# Altium schematic sheet control_unit.SchDoc
size A3
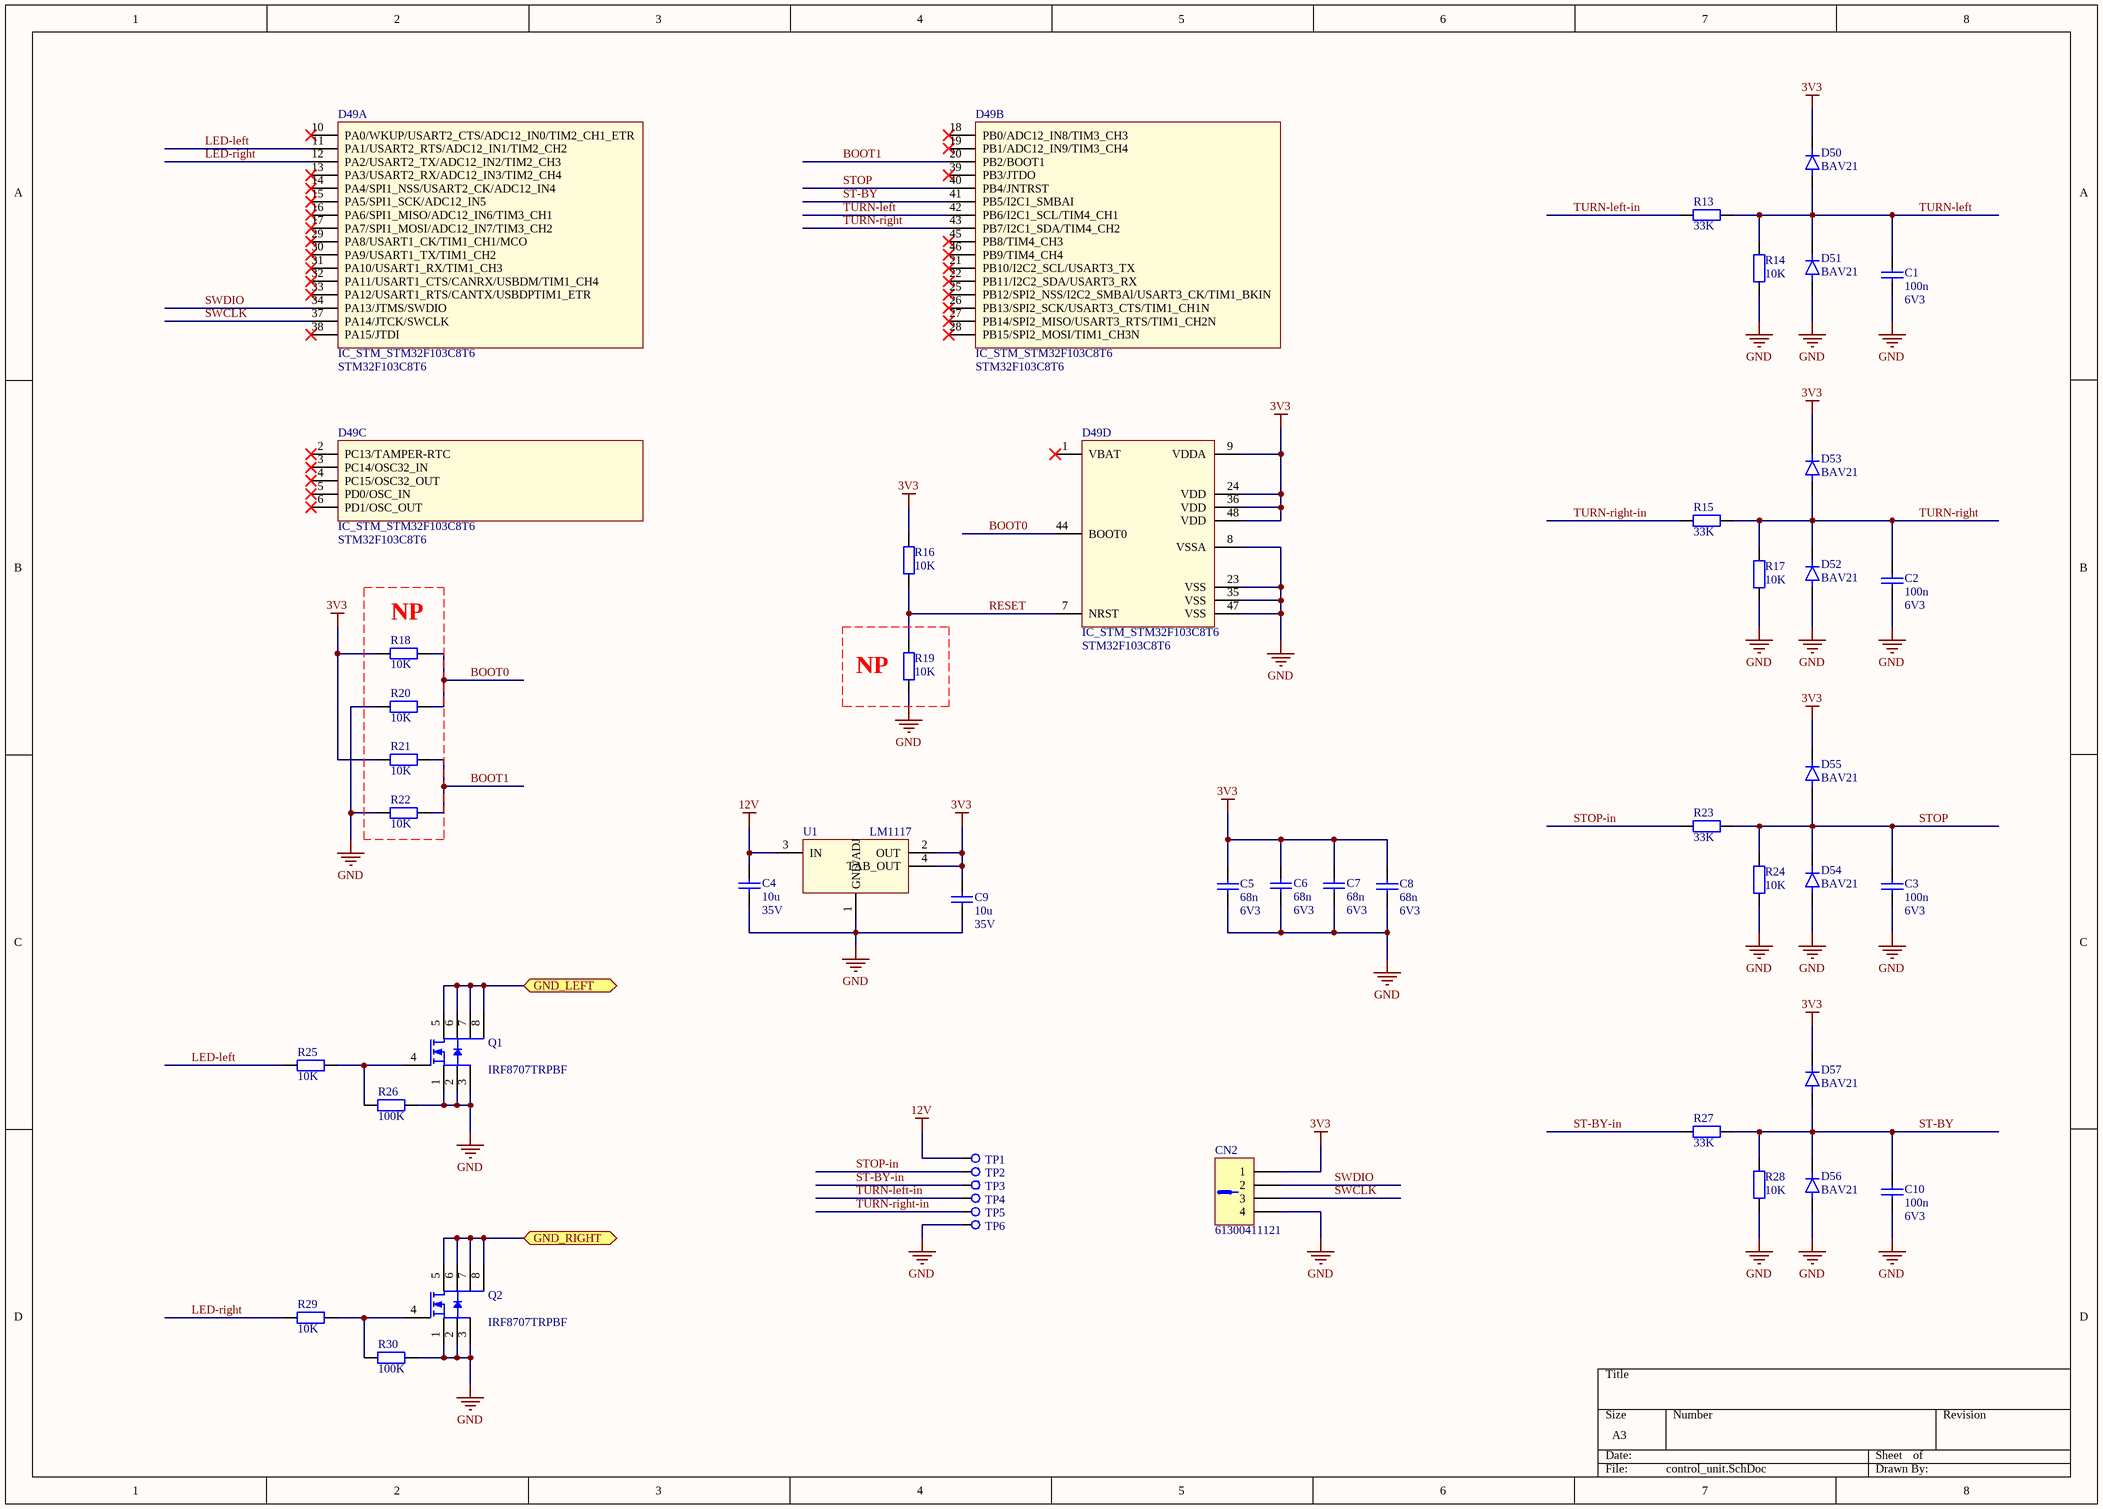
[diagram p0: control_unit.SchDoc]

## Parts
C1  Value1: 100n  Value2: 6V3  [CAPC2012X88N]  (hidden comment: CAP)
C2  Value1: 100n  Value2: 6V3  [CAPC2012X88N]  (hidden comment: CAP)
C3  Value1: 100n  Value2: 6V3  [CAPC2012X88N]  (hidden comment: CAP)
C4  Value1: 10u  Value2: 35V  [CAPC3216X18N]  (hidden comment: CAP)
C5  Value1: 68n  Value2: 6V3  [CAPC2012X100N]  (hidden comment: CAP)
C6  Value1: 68n  Value2: 6V3  [CAPC2012X100N]  (hidden comment: CAP)
C7  Value1: 68n  Value2: 6V3  [CAPC2012X100N]  (hidden comment: CAP)
C8  Value1: 68n  Value2: 6V3  [CAPC2012X100N]  (hidden comment: CAP)
C9  Value1: 10u  Value2: 35V  [CAPC3216X18N]  (hidden comment: CAP)
C10  Value1: 100n  Value2: 6V3  [CAPC2012X88N]  (hidden comment: CAP)
CN2  Value1: 61300411121  [CN_WURTH_61300411121]  (hidden comment: CN_1X4M)
D49  IC_STM_STM32F103C8T6  Value1: STM32F103C8T6  [TSQFP50P900X900X160-48N]  (parts A,B,C,D of 4)
D50  Value1: BAV21  [SODFL370X136-2M]  (hidden comment: DIO)
D51  Value1: BAV21  [SODFL370X136-2M]  (hidden comment: DIO)
D52  Value1: BAV21  [SODFL370X136-2M]  (hidden comment: DIO)
D53  Value1: BAV21  [SODFL370X136-2M]  (hidden comment: DIO)
D54  Value1: BAV21  [SODFL370X136-2M]  (hidden comment: DIO)
D55  Value1: BAV21  [SODFL370X136-2M]  (hidden comment: DIO)
D56  Value1: BAV21  [SODFL370X136-2M]  (hidden comment: DIO)
D57  Value1: BAV21  [SODFL370X136-2M]  (hidden comment: DIO)
Q1  Value1: IRF8707TRPBF  [SOIC127P600X175-8N]  (hidden comment: TRS_INFINEON_IRF8707TRPBF)
Q2  Value1: IRF8707TRPBF  [SOIC127P600X175-8N]  (hidden comment: TRS_INFINEON_IRF8707TRPBF)
R13  Value1: 33K  [RESC2012X60N]  (hidden comment: RES)
R14  Value1: 10K  [RESC2012X60N]  (hidden comment: RES)
R15  Value1: 33K  [RESC2012X60N]  (hidden comment: RES)
R16  Value1: 10K  [RESC2012X60N]  (hidden comment: RES)
R17  Value1: 10K  [RESC2012X60N]  (hidden comment: RES)
R18  Value1: 10K  [RESC2012X60N]  (hidden comment: RES)
R19  Value1: 10K  [RESC2012X60N]  (hidden comment: RES)
R20  Value1: 10K  [RESC2012X60N]  (hidden comment: RES)
R21  Value1: 10K  [RESC2012X60N]  (hidden comment: RES)
R22  Value1: 10K  [RESC2012X60N]  (hidden comment: RES)
R23  Value1: 33K  [RESC2012X60N]  (hidden comment: RES)
R24  Value1: 10K  [RESC2012X60N]  (hidden comment: RES)
R25  Value1: 10K  [RESC2012X60N]  (hidden comment: RES)
R26  Value1: 100K  [RESC2012X60N]  (hidden comment: RES)
R27  Value1: 33K  [RESC2012X60N]  (hidden comment: RES)
R28  Value1: 10K  [RESC2012X60N]  (hidden comment: RES)
R29  Value1: 10K  [RESC2012X60N]  (hidden comment: RES)
R30  Value1: 100K  [RESC2012X60N]  (hidden comment: RES)
TP1  MSC_TP  [MSC_TP_THT1MM]  (value not drawn)  (no BOM)
TP2  MSC_TP  [MSC_TP_THT1MM]  (value not drawn)  (no BOM)
TP3  MSC_TP  [MSC_TP_THT1MM]  (value not drawn)  (no BOM)
TP4  MSC_TP  [MSC_TP_THT1MM]  (value not drawn)  (no BOM)
TP5  MSC_TP  [MSC_TP_THT1MM]  (value not drawn)  (no BOM)
TP6  MSC_TP  [MSC_TP_THT1MM]  (value not drawn)  (no BOM)
U1  Value1: LM1117  [IC_TI_LM1117]  (hidden comment: IC_TI_LM1117)

## Ports
GND_LEFT, GND_RIGHT

## Nets
3V3: C5.2 C6.2 C7.2 C8.2 C9.2 CN2.1 D49.9(VDDA) D49.24(VDD) D49.36(VDD) D49.48(VDD) D50.1(K) D53.1(K) D55.1(K) D57.1(K) R16.2 R18.1 R21.1 U1.2(OUT) U1.4(TAB_OUT)
12V: C4.2 TP1.1 U1.3(IN)
GND: C1.1 C2.1 C3.1 C4.1 C5.1 C6.1 C7.1 C8.1 C9.1 C10.1 CN2.4 D49.8(VSSA) D49.23(VSS) D49.35(VSS) D49.47(VSS) D51.2(A) D52.2(A) D54.2(A) D56.2(A) Q1.1(S) Q1.2(S) Q1.3(D) Q2.1(S) Q2.2(S) Q2.3(D) R14.1 R17.2 R19.1 R20.1 R22.1 R24.2 R26.2 R28.1 R30.2 TP6.1 U1.1(GND/ADJ)
BOOT0: D49.44(BOOT0) R18.2 R20.2
BOOT1: D49.20(PB2/BOOT1) R21.2 R22.2
GND_LEFT: Q1.5(D) Q1.6(D) Q1.7(D) Q1.8(D) ; port GND_LEFT
GND_RIGHT: Q2.5(D) Q2.6(D) Q2.7(D) Q2.8(D) ; port GND_RIGHT
LED-left: D49.11(PA1/USART2_RTS/ADC12_IN1/TIM2_CH2) R25.2
LED-right: D49.12(PA2/USART2_TX/ADC12_IN2/TIM2_CH3) R29.2
RESET: D49.7(NRST) R16.1 R19.2
ST-BY: C10.2 D49.41(PB5/I2C1_SMBAI) D56.1(K) D57.2(A) R27.2 R28.2
ST-BY-in: R27.1 TP3.1
STOP: C3.2 D49.40(PB4/JNTRST) D54.1(K) D55.2(A) R23.2 R24.1
STOP-in: R23.1 TP2.1
SWCLK: CN2.3 D49.37(PA14/JTCK/SWCLK)
SWDIO: CN2.2 D49.34(PA13/JTMS/SWDIO)
TURN-left: C1.2 D49.42(PB6/I2C1_SCL/TIM4_CH1) D50.2(A) D51.1(K) R13.2 R14.2
TURN-left-in: R13.1 TP4.1
TURN-right: C2.2 D49.43(PB7/I2C1_SDA/TIM4_CH2) D52.1(K) D53.2(A) R15.2 R17.1
TURN-right-in: R15.1 TP5.1
NetQ1_4: Q1.4(G) R25.1 R26.1
NetQ2_4: Q2.4(G) R29.1 R30.1

Not connected (* = marked no-connect by the designer): D49 1(VBAT)* 2(PC13/TAMPER-RTC)* 3(PC14/OSC32_IN)* 4(PC15/OSC32_OUT)* 5(PD0/OSC_IN)* 6(PD1/OSC_OUT)* 10(PA0/WKUP/USART2_CTS/ADC12_IN0/TIM2_CH1_ETR)* 13(PA3/USART2_RX/ADC12_IN3/TIM2_CH4)* 14(PA4/SPI1_NSS/USART2_CK/ADC12_IN4)* 15(PA5/SPI1_SCK/ADC12_IN5)* 16(PA6/SPI1_MISO/ADC12_IN6/TIM3_CH1)* 17(PA7/SPI1_MOSI/ADC12_IN7/TIM3_CH2)* 18(PB0/ADC12_IN8/TIM3_CH3)* 19(PB1/ADC12_IN9/TIM3_CH4)* 21(PB10/I2C2_SCL/USART3_TX)* 22(PB11/I2C2_SDA/USART3_RX)* 25(PB12/SPI2_NSS/I2C2_SMBAl/USART3_CK/TIM1_BKIN)* 26(PB13/SPI2_SCK/USART3_CTS/TIM1_CH1N)* 27(PB14/SPI2_MISO/USART3_RTS/TIM1_CH2N)* 28(PB15/SPI2_MOSI/TIM1_CH3N)* 29(PA8/USART1_CK/TIM1_CH1/MCO)* 30(PA9/USART1_TX/TIM1_CH2)* 31(PA10/USART1_RX/TIM1_CH3)* 32(PA11/USART1_CTS/CANRX/USBDM/TIM1_CH4)* 33(PA12/USART1_RTS/CANTX/USBDPTIM1_ETR)* 38(PA15/JTDI)* 39(PB3/JTDO)* 45(PB8/TIM4_CH3)* 46(PB9/TIM4_CH4)*

## Notes on the sheet
- (near R18) NP
- (near R19) NP

## Library data of the parts
C1-C3 C10 = 01_00637: X7R 10% 0805; Manufacturer: KEMET; Manufacturer PN: C0805C104K9RACTU; AutoId: 637; DeviceType: capacitor; SubType: Ceramic; Id: 01_00637; Status: 2 - Checked and Approved; MountType: SMT; ComponentLink1URL: X:\01_Datasheets\CAP_KEMET_CxxxxCxxxXxRAC.pdf; Supplier 1: Farnell; Supplier Part Number 1: 80-C0805C104K9R; ComponentLink1Description: Datasheet
C4 C9 = 01_01484: MURATA - GRM31CR6YA106KA12L - CAP, MLCC, X5R, 10UF, 35V, 1206; AutoId: 1484; DeviceType: capacitor; SubType: Ceramic; Id: 01_01484; Manufacturer: Murata; Manufacturer PN: GRM31CR6YA106KA12L; Status: 2 - Checked and Approved; MountType: SMD; ComponentLink1URL: X:\01_dataSheets\CAP_MURATA_GRM31CR6YA106KA12L.pdf; Supplier 1: Farnell; Supplier Part Number 1: 1797011; ComponentLink1Description: Datasheet
C5-C8 = 01_00635: X7R 10% 0805; Manufacturer: KEMET; Manufacturer PN: C0805C683K9RACTU; AutoId: 635; DeviceType: capacitor; SubType: Ceramic; Id: 01_00635; Status: 2 - Checked and Approved; MountType: SMT; ComponentLink1URL: X:\01_Datasheets\CAP_KEMET_CxxxxCxxxXxRAC.pdf; Supplier 1: Farnell; ComponentLink1Description: Datasheet
CN2 = 02_00034: 4 pin male pin header, pitch 2.54mm; Manufacturer: Wurth Electronics; AutoId: 36; Value3: 4 pin; DeviceType: Connector_4; SubType: 1x4; Id: 02_00034; Manufacturer PN: 61300411121; Status: 2 - Checked and Approved; MountType: THT; ComponentLink1Description: Datasheet; ComponentLink1URL: X:\01_Datasheets\CN_WURTH_6130xx11121.pdf; ComponentLink2Description: ComponentVerificationSheet; ComponentLink2URL: X:\02_ComponentVerificationSheets\CN_WURTH_61300411121_ComponentVerificationSheet.xlsx; Supplier 1: Wurth; Supplier Part Number 1: 61300411121
D49 = 07_00285: MCU 32BIT Cortex M3 64KB 20KB RAM 2X12 ADC; Manufacturer: STM; AutoId: 292; Value2: Microcontroller; Value3: ARM 32bit; DeviceType: IC; Id: 07_00285; Manufacturer PN: STM32F103C8T6; Status: 0 - Unchecked; MountType: SMT; ComponentLink1Description: Datasheet; ComponentLink1URL: X:\01_Datasheets\IC_STM_STM32F103C8T6.pdf; ComponentLink2Description: ComponentVerificationSheet; ComponentLink2URL: X:\02_ComponentVerificationSheets\; Supplier 1: Mouser; Supplier Part Number 1: 511-STM32F103C8T6
D50-D57 = 03_00081: Diodes - General Purpose, Power, Switching 250V 625mA 1A IFSM; Manufacturer: Vishay; Manufacturer PN: BAV21W-E3-08; AutoId: 91; Value2: 250V 250mA; Value3: Diode; Id: 03_00081; DeviceType: diode; SubType: general; Status: 0 - Unchecked; MountType: SMD; ComponentLink1Description: Datasheet; ComponentLink1URL: X:\01_Datasheets\DIO_Vishay_BAV21.pdf; ComponentLink2Description: ComponentVerificationSheet; ComponentLink2URL: X:\02_ComponentVerificationSheets\; Supplier 1: Mouser; Supplier Part Number 1: 78-BAV21W-E3-08
Q1 Q2 = 19_00042: MOSFET MOSFT 30V 11A 11.9mOhm 6.2nC Qg; AutoId: 48; Value2: 30V 11A; DeviceType: transistor; SubType: N MOSFET; Id: 19_00042; Manufacturer: Infineon; Manufacturer PN: IRF8707TRPBF; Status: 0 - Unchecked; MountType: SMT; ComponentLink1Description: Datasheet; ComponentLink1URL: X:\01_Datasheets\TRS_INFINEON_IRF8707TRPBF.pdf; ComponentLink2Description: ComponentVerificationSheet; ComponentLink2URL: X:\02_ComponentVerificationSheets\; Supplier 1: Mouser; Supplier Part Number 1: 942-IRF8707TRPBF
R13 R15 R23 R27 = 15_00347: RESISTOR, 0805, 33K, 1%, SMD; Manufacturer: Yageo; Manufacturer PN: RC0805FR-0733K; AutoId: 347; Value2: 0W125; SubType: Metal film; Id: 15_00347; DeviceType: resistor; Status: 0 - Unchecked; MountType: SMT; ComponentLink1Description: Datasheet; ComponentLink1URL: X:\01_Datasheets\RES_YAGEO_RC0805FR.pdf; Supplier 1: Farnell
R14 R16-R22 R24 R25 R28 R29 = 15_00341: RESISTOR, 0805, 10K, 1%, SMD; Manufacturer: Yageo; Manufacturer PN: RC0805FR-0710K; AutoId: 341; Value2: 0W125; SubType: Metal film; Id: 15_00341; DeviceType: resistor; Status: 0 - Unchecked; MountType: SMT; ComponentLink1Description: Datasheet; ComponentLink1URL: X:\01_Datasheets\RES_YAGEO_RC0805FR.pdf; Supplier 1: Farnell
R26 R30 = 15_00353: RESISTOR, 0805, 100K, 1%, SMD; Manufacturer: Yageo; Manufacturer PN: RC0805FR-07100K; AutoId: 353; Value2: 0W125; SubType: Metal film; Id: 15_00353; DeviceType: resistor; Status: 0 - Unchecked; MountType: SMT; ComponentLink1Description: Datasheet; ComponentLink1URL: X:\01_Datasheets\RES_YAGEO_RC0805FR.pdf; Supplier 1: Farnell
TP1-TP6 = 12_00001: With Hole for 1 header pin; Value1: TESTPOINT_TH; AutoId: 2; Value2: NO BUY; Id: 12_00001; Status: 0 - Unchecked; MountType: THT; ComponentLink1Description: Datasheet; ComponentLink1URL: X:\01_Datasheets\; ComponentLink2Description: ComponentVerificationSheet; ComponentLink2URL: X:\02_ComponentVerificationSheets\
U1 = 07_00244: LDO Voltage Regulators 800MA LDO LINEAR REG; Manufacturer: TI; Manufacturer PN: LM1117MPX-3.3/NOPB; AutoId: 242; Value3: 3V3; Id: 07_00244; Value2: LDO; DeviceType: LDO; Status: 0 - Unchecked; MountType: SMT; ComponentLink1Description: Datasheet; ComponentLink1URL: X:\01_Datasheets\IC_TI_LM1117.pdf; ComponentLink2Description: ComponentVerificationSheet; ComponentLink2URL: X:\02_ComponentVerificationSheets\; Supplier 1: Mouser; Supplier Part Number 1: 926-LM1117MPX3.3NOPB